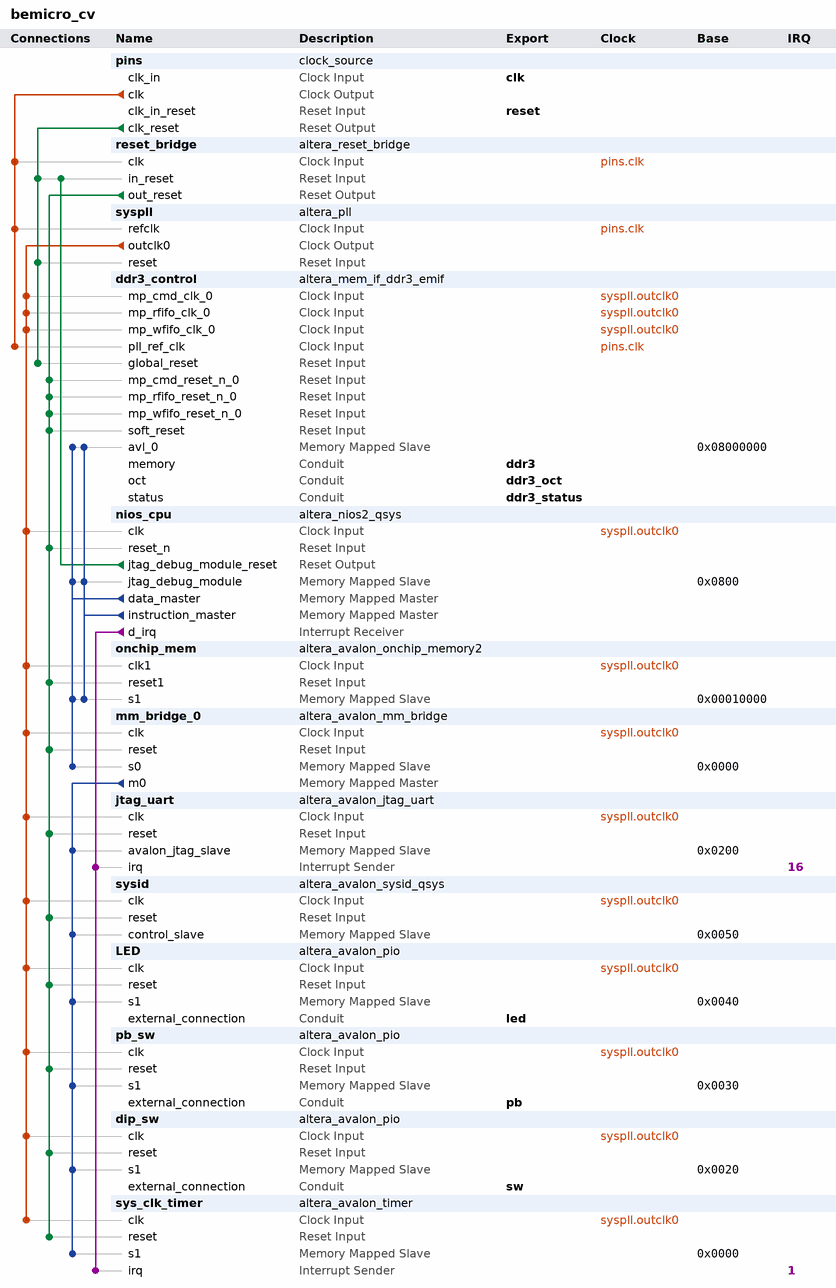
[diagram p0: system contents]
# Platform Designer (Qsys) system bemicro_cv, Cyclone V 5CEFA2F23C8
# Parameters at their usual value, and those the tool derives, are not listed.
package require -exact qsys 13.0
create_system bemicro_cv
set_project_property DEVICE_FAMILY {Cyclone V}
set_project_property DEVICE 5CEFA2F23C8

add_instance pins clock_source 13.0
set_instance_parameter_value pins clockFrequency 50000000

add_instance reset_bridge altera_reset_bridge 13.0
set_instance_parameter_value reset_bridge ACTIVE_LOW_RESET 0
set_instance_parameter_value reset_bridge SYNCHRONOUS_EDGES deassert

add_instance syspll altera_pll 13.0
set_instance_parameter_value syspll gui_device_speed_grade 8
set_instance_parameter_value syspll gui_pll_mode {Integer-N PLL}
set_instance_parameter_value syspll gui_reference_clock_frequency 50.0
set_instance_parameter_value syspll gui_operation_mode normal
set_instance_parameter_value syspll gui_use_locked true
set_instance_parameter_value syspll gui_number_of_clocks 2
set_instance_parameter_value syspll gui_output_clock_frequency0 80.0
set_instance_parameter_value syspll gui_output_clock_frequency1 80.0
set_instance_parameter_value syspll gui_phase_shift_deg1 0

add_instance ddr3_control altera_mem_if_ddr3_emif 13.0
set_instance_parameter_value ddr3_control MEM_VENDOR Micron
set_instance_parameter_value ddr3_control MEM_FORMAT DISCRETE
set_instance_parameter_value ddr3_control MEM_CLK_FREQ_MAX 666.667
set_instance_parameter_value ddr3_control MEM_ROW_ADDR_WIDTH 13
set_instance_parameter_value ddr3_control MEM_COL_ADDR_WIDTH 10
set_instance_parameter_value ddr3_control MEM_DQ_WIDTH 16
set_instance_parameter_value ddr3_control MEM_BANKADDR_WIDTH 3
set_instance_parameter_value ddr3_control MEM_DRV_STR RZQ/6
set_instance_parameter_value ddr3_control MEM_RTT_NOM RZQ/2
set_instance_parameter_value ddr3_control MEM_RTT_WR RZQ/2
set_instance_parameter_value ddr3_control MEM_WTCL 6
set_instance_parameter_value ddr3_control MEM_TCL 9
set_instance_parameter_value ddr3_control TIMING_TIS 190
set_instance_parameter_value ddr3_control TIMING_TIH 140
set_instance_parameter_value ddr3_control TIMING_TDS 30
set_instance_parameter_value ddr3_control TIMING_TDH 65
set_instance_parameter_value ddr3_control TIMING_TDQSQ 125
set_instance_parameter_value ddr3_control TIMING_TDQSCK 255
set_instance_parameter_value ddr3_control TIMING_TDQSS 0.25
set_instance_parameter_value ddr3_control TIMING_TQSH 0.4
set_instance_parameter_value ddr3_control TIMING_TDSH 0.2
set_instance_parameter_value ddr3_control TIMING_TDSS 0.2
set_instance_parameter_value ddr3_control MEM_TRAS_NS 36.0
set_instance_parameter_value ddr3_control MEM_TRCD_NS 13.5
set_instance_parameter_value ddr3_control MEM_TRP_NS 13.5
set_instance_parameter_value ddr3_control MEM_TRFC_NS 110.0
set_instance_parameter_value ddr3_control MEM_TWTR 4
set_instance_parameter_value ddr3_control MEM_TFAW_NS 45.0
set_instance_parameter_value ddr3_control MEM_TRRD_NS 7.5
set_instance_parameter_value ddr3_control MEM_TRTP_NS 7.5
set_instance_parameter_value ddr3_control RATE Full
set_instance_parameter_value ddr3_control MEM_CLK_FREQ 300.0
set_instance_parameter_value ddr3_control SPEED_GRADE 8
set_instance_parameter_value ddr3_control HARD_EMIF true
set_instance_parameter_value ddr3_control POWER_OF_TWO_BUS true
set_instance_parameter_value ddr3_control SOPC_COMPAT_RESET true
set_instance_parameter_value ddr3_control AVL_MAX_SIZE 4
set_instance_parameter_value ddr3_control CFG_REORDER_DATA false
set_instance_parameter_value ddr3_control AVL_DATA_WIDTH_PORT 32,128,32,32,32,32
set_instance_parameter_value ddr3_control PRIORITY_PORT 1,1,1,1,1,1
set_instance_parameter_value ddr3_control CPORT_TYPE_PORT Bidirectional,Bidirectional,Bidirectional,Bidirectional,Bidirectional,Bidirectional
set_instance_parameter_value ddr3_control REF_CLK_FREQ 50.0
set_instance_parameter_value ddr3_control DEFAULT_FAST_SIM_MODEL true
set_instance_parameter_value ddr3_control EXPORT_AFI_HALF_CLK true
set_instance_parameter_value ddr3_control PLL_LOCATION Top_Bottom
set_instance_parameter_value ddr3_control CALIBRATION_MODE Skip
set_instance_parameter_value ddr3_control USER_DEBUG_LEVEL 0
set_instance_parameter_value ddr3_control TIMING_BOARD_MAX_CK_DELAY 0.6
set_instance_parameter_value ddr3_control TIMING_BOARD_MAX_DQS_DELAY 0.6
set_instance_parameter_value ddr3_control TIMING_BOARD_SKEW_CKDQS_DIMM_MIN -0.01
set_instance_parameter_value ddr3_control TIMING_BOARD_SKEW_CKDQS_DIMM_MAX 0.01
set_instance_parameter_value ddr3_control TIMING_BOARD_SKEW_WITHIN_DQS 0.02
set_instance_parameter_value ddr3_control TIMING_BOARD_SKEW_BETWEEN_DQS 0.02
set_instance_parameter_value ddr3_control TIMING_BOARD_DQ_TO_DQS_SKEW 0.0
set_instance_parameter_value ddr3_control TIMING_BOARD_AC_SKEW 0.02
set_instance_parameter_value ddr3_control TIMING_BOARD_AC_TO_CK_SKEW 0.0

add_instance nios_cpu altera_nios2_qsys 13.0
set_instance_parameter_value nios_cpu debug_embeddedPLL false
set_instance_parameter_value nios_cpu cpuID -889275714
set_instance_parameter_value nios_cpu resetSlave onchip_mem.s1
set_instance_parameter_value nios_cpu mmu_TLBMissExcSlave None
set_instance_parameter_value nios_cpu exceptionSlave onchip_mem.s1
set_instance_parameter_value nios_cpu breakSlave nios_cpu.jtag_debug_module
set_instance_parameter_value nios_cpu impl Fast
set_instance_parameter_value nios_cpu icache_size 4096
set_instance_parameter_value nios_cpu icache_burstType Sequential
set_instance_parameter_value nios_cpu dcache_bursts true
set_instance_parameter_value nios_cpu dcache_size 4096

add_instance onchip_mem altera_avalon_onchip_memory2 13.0.1.99.2
set_instance_parameter_value onchip_mem dataWidth 32
set_instance_parameter_value onchip_mem dualPort false
set_instance_parameter_value onchip_mem initMemContent true
set_instance_parameter_value onchip_mem initializationFileName onchip_mem.hex
set_instance_parameter_value onchip_mem memorySize 65536
set_instance_parameter_value onchip_mem useNonDefaultInitFile true

add_instance mm_bridge_0 altera_avalon_mm_bridge 13.0
set_instance_parameter_value mm_bridge_0 DATA_WIDTH 32
set_instance_parameter_value mm_bridge_0 ADDRESS_WIDTH 10
set_instance_parameter_value mm_bridge_0 ADDRESS_UNITS SYMBOLS
set_instance_parameter_value mm_bridge_0 MAX_PENDING_RESPONSES 4

add_instance jtag_uart altera_avalon_jtag_uart 13.0.1.99.2
set_instance_parameter_value jtag_uart simInteractiveOptions NO_INTERACTIVE_WINDOWS

add_instance sysid altera_avalon_sysid_qsys 13.0
set_instance_parameter_value sysid id -2023406815

add_instance LED altera_avalon_pio 13.0.1.99.2
set_instance_parameter_value LED direction Output
set_instance_parameter_value LED width 8

add_instance pb_sw altera_avalon_pio 13.0.1.99.2
set_instance_parameter_value pb_sw direction Input
set_instance_parameter_value pb_sw width 2

add_instance dip_sw altera_avalon_pio 13.0.1.99.2
set_instance_parameter_value dip_sw direction Input
set_instance_parameter_value dip_sw width 3

add_instance sys_clk_timer altera_avalon_timer 13.0.1.99.2
set_instance_parameter_value sys_clk_timer period 1
set_instance_parameter_value sys_clk_timer periodUnits MSEC

# connections
add_connection pins.clk ddr3_control.pll_ref_clk clock
add_connection pins.clk reset_bridge.clk clock
add_connection pins.clk syspll.refclk clock
add_connection syspll.outclk0 ddr3_control.mp_cmd_clk_0 clock
add_connection syspll.outclk0 ddr3_control.mp_rfifo_clk_0 clock
add_connection syspll.outclk0 ddr3_control.mp_wfifo_clk_0 clock
add_connection syspll.outclk0 dip_sw.clk clock
add_connection syspll.outclk0 jtag_uart.clk clock
add_connection syspll.outclk0 LED.clk clock
add_connection syspll.outclk0 mm_bridge_0.clk clock
add_connection syspll.outclk0 nios_cpu.clk clock
add_connection syspll.outclk0 onchip_mem.clk1 clock
add_connection syspll.outclk0 pb_sw.clk clock
add_connection syspll.outclk0 sys_clk_timer.clk clock
add_connection syspll.outclk0 sysid.clk clock
add_connection nios_cpu.jtag_debug_module_reset reset_bridge.in_reset reset
add_connection pins.clk_reset ddr3_control.global_reset reset
add_connection pins.clk_reset reset_bridge.in_reset reset
add_connection pins.clk_reset syspll.reset reset
add_connection reset_bridge.out_reset ddr3_control.mp_cmd_reset_n_0 reset
add_connection reset_bridge.out_reset ddr3_control.mp_rfifo_reset_n_0 reset
add_connection reset_bridge.out_reset ddr3_control.mp_wfifo_reset_n_0 reset
add_connection reset_bridge.out_reset ddr3_control.soft_reset reset
add_connection reset_bridge.out_reset dip_sw.reset reset
add_connection reset_bridge.out_reset jtag_uart.reset reset
add_connection reset_bridge.out_reset LED.reset reset
add_connection reset_bridge.out_reset mm_bridge_0.reset reset
add_connection reset_bridge.out_reset nios_cpu.reset_n reset
add_connection reset_bridge.out_reset onchip_mem.reset1 reset
add_connection reset_bridge.out_reset pb_sw.reset reset
add_connection reset_bridge.out_reset sys_clk_timer.reset reset
add_connection reset_bridge.out_reset sysid.reset reset
add_connection mm_bridge_0.m0 dip_sw.s1 avalon
set_connection_parameter_value mm_bridge_0.m0/dip_sw.s1 baseAddress 0x0020
add_connection mm_bridge_0.m0 jtag_uart.avalon_jtag_slave avalon
set_connection_parameter_value mm_bridge_0.m0/jtag_uart.avalon_jtag_slave baseAddress 0x0200
add_connection mm_bridge_0.m0 LED.s1 avalon
set_connection_parameter_value mm_bridge_0.m0/LED.s1 baseAddress 0x0040
add_connection mm_bridge_0.m0 pb_sw.s1 avalon
set_connection_parameter_value mm_bridge_0.m0/pb_sw.s1 baseAddress 0x0030
add_connection mm_bridge_0.m0 sys_clk_timer.s1 avalon
set_connection_parameter_value mm_bridge_0.m0/sys_clk_timer.s1 baseAddress 0x0000
add_connection mm_bridge_0.m0 sysid.control_slave avalon
set_connection_parameter_value mm_bridge_0.m0/sysid.control_slave baseAddress 0x0050
add_connection nios_cpu.data_master ddr3_control.avl_0 avalon
set_connection_parameter_value nios_cpu.data_master/ddr3_control.avl_0 baseAddress 0x08000000
add_connection nios_cpu.data_master mm_bridge_0.s0 avalon
set_connection_parameter_value nios_cpu.data_master/mm_bridge_0.s0 baseAddress 0x0000
add_connection nios_cpu.data_master nios_cpu.jtag_debug_module avalon
set_connection_parameter_value nios_cpu.data_master/nios_cpu.jtag_debug_module baseAddress 0x0800
add_connection nios_cpu.data_master onchip_mem.s1 avalon
set_connection_parameter_value nios_cpu.data_master/onchip_mem.s1 baseAddress 0x00010000
add_connection nios_cpu.instruction_master ddr3_control.avl_0 avalon
set_connection_parameter_value nios_cpu.instruction_master/ddr3_control.avl_0 baseAddress 0x08000000
add_connection nios_cpu.instruction_master nios_cpu.jtag_debug_module avalon
set_connection_parameter_value nios_cpu.instruction_master/nios_cpu.jtag_debug_module baseAddress 0x0800
add_connection nios_cpu.instruction_master onchip_mem.s1 avalon
set_connection_parameter_value nios_cpu.instruction_master/onchip_mem.s1 baseAddress 0x00010000
add_connection nios_cpu.d_irq jtag_uart.irq interrupt
set_connection_parameter_value nios_cpu.d_irq/jtag_uart.irq irqNumber 16
add_connection nios_cpu.d_irq sys_clk_timer.irq interrupt
set_connection_parameter_value nios_cpu.d_irq/sys_clk_timer.irq irqNumber 1

# exported interfaces
add_interface led conduit end
set_interface_property led EXPORT_OF LED.external_connection
add_interface sw conduit end
set_interface_property sw EXPORT_OF dip_sw.external_connection
add_interface pb conduit end
set_interface_property pb EXPORT_OF pb_sw.external_connection
add_interface ddr3 conduit end
set_interface_property ddr3 EXPORT_OF ddr3_control.memory
add_interface reset reset sink
set_interface_property reset EXPORT_OF pins.clk_in_reset
add_interface ddr3_oct conduit end
set_interface_property ddr3_oct EXPORT_OF ddr3_control.oct
add_interface ddr3_status conduit end
set_interface_property ddr3_status EXPORT_OF ddr3_control.status
add_interface clk clock sink
set_interface_property clk EXPORT_OF pins.clk_in

set_interconnect_requirement {$system} qsys_mm.clockCrossingAdapter HANDSHAKE
set_interconnect_requirement {$system} qsys_mm.maxAdditionalLatency 1

save_system bemicro_cv.qsys
